# Altium project VESC_MotorController.PrjPcb
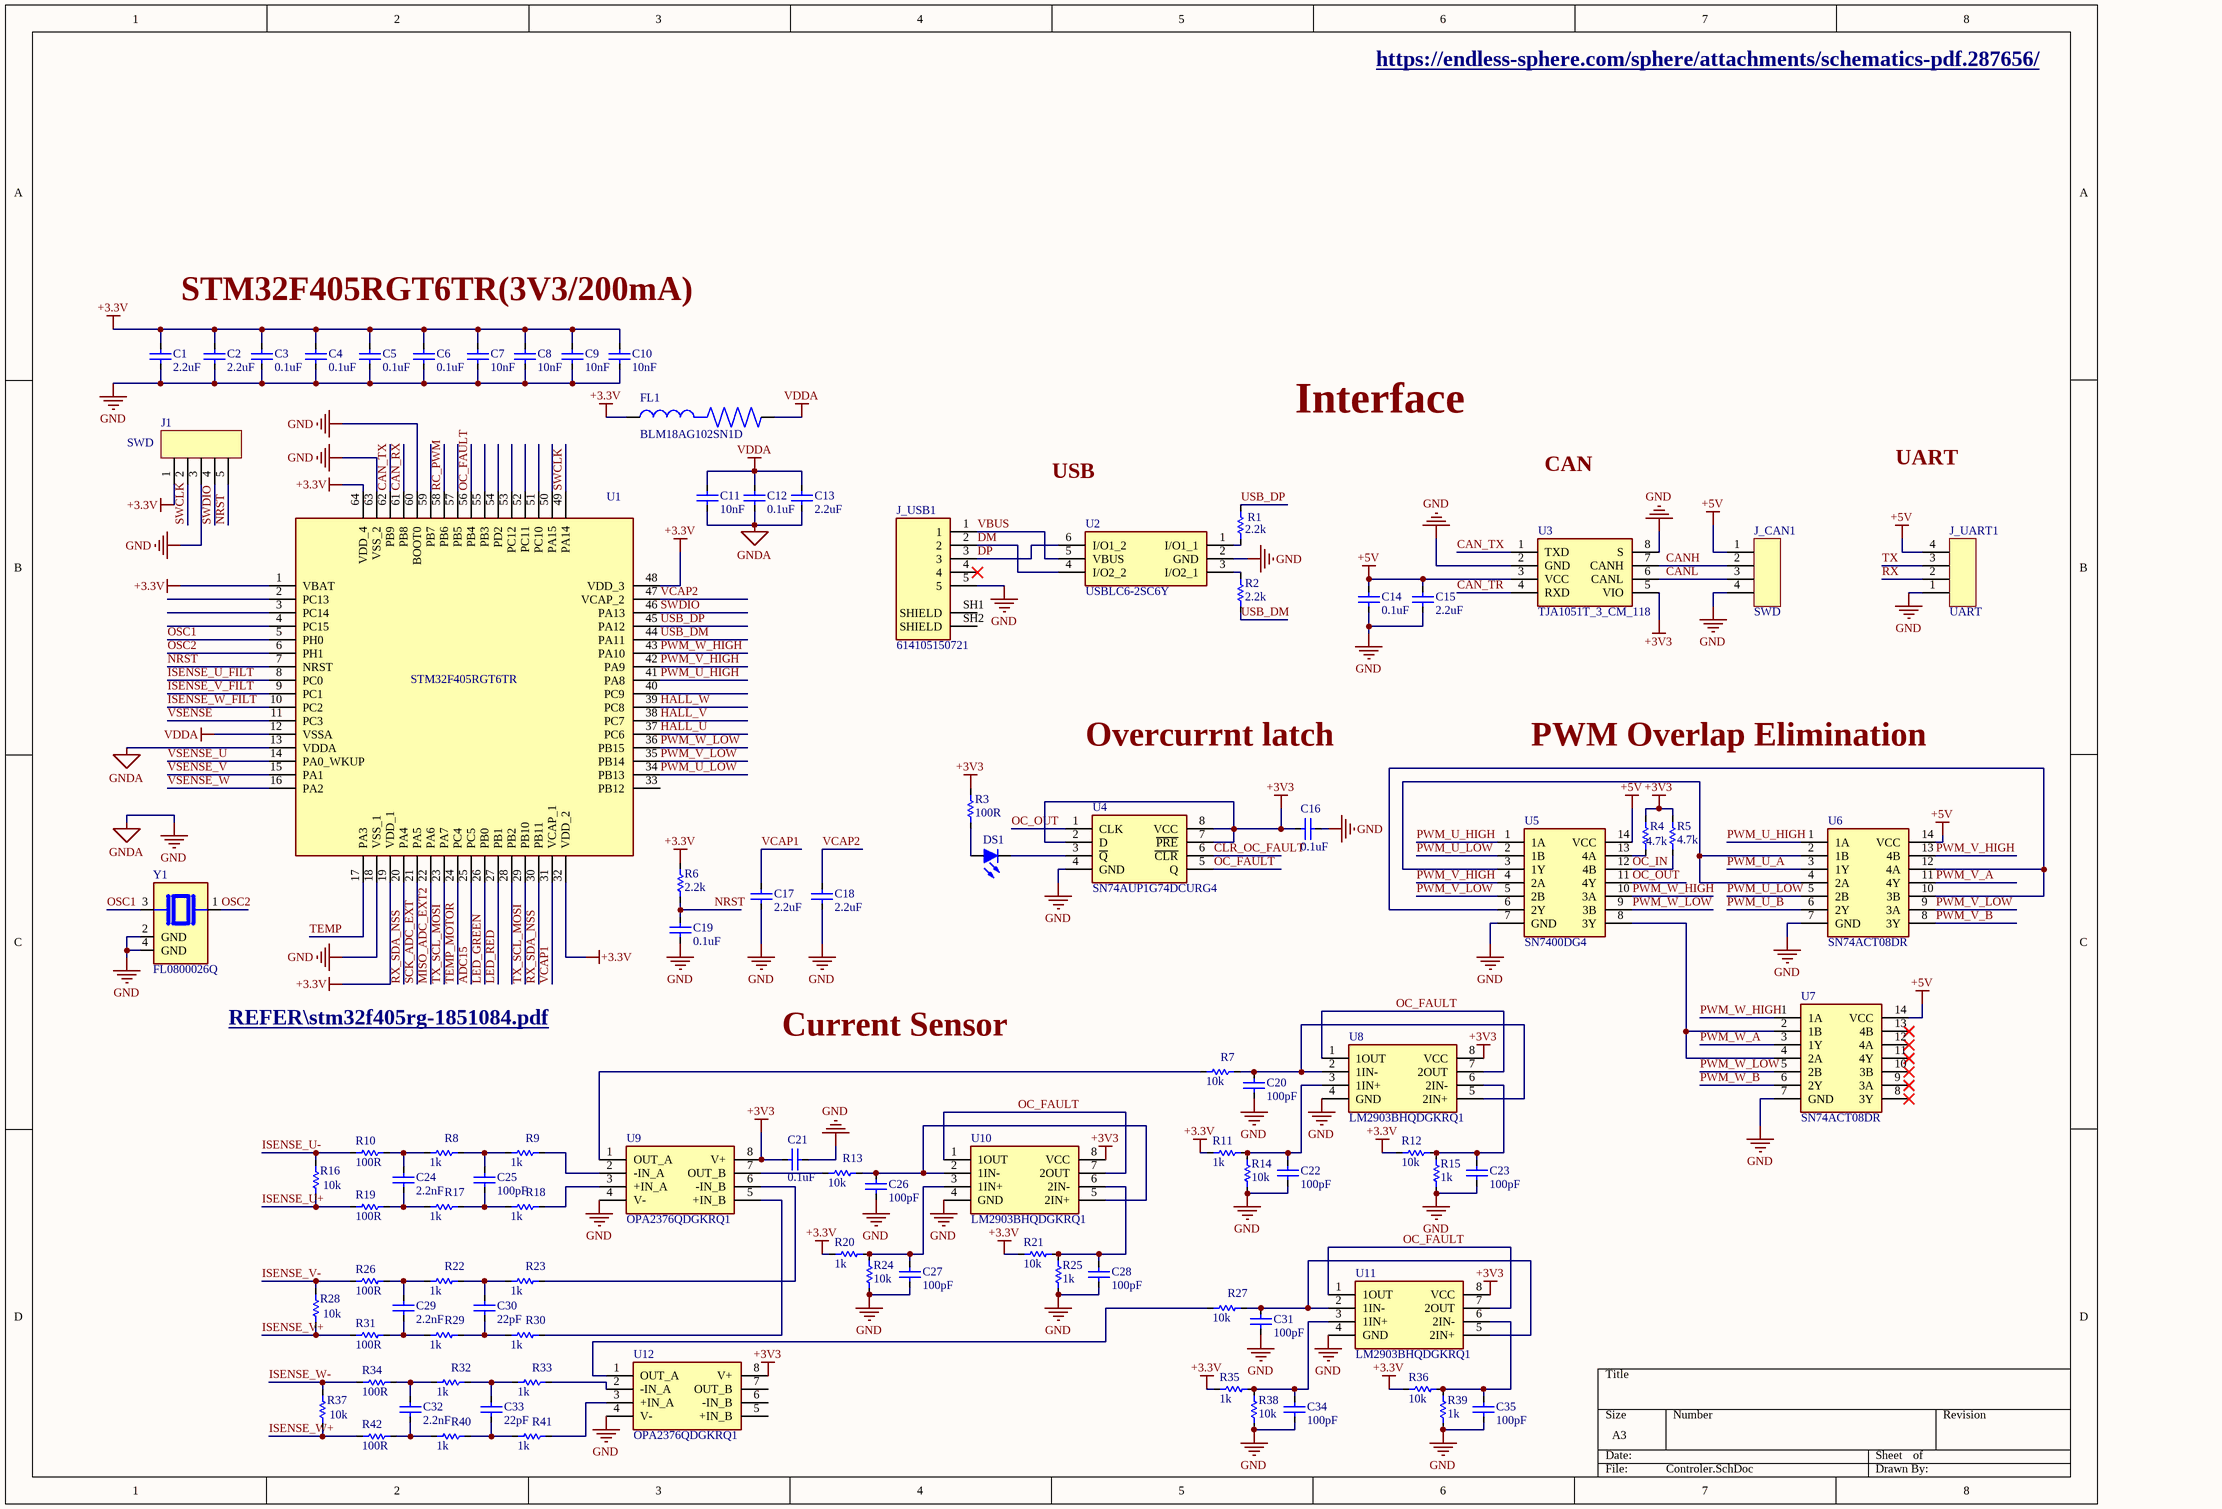
[diagram p0: Controler.SchDoc]
2 sheets, 226 parts. Net scope: global (net labels, ports and power ports of the same name join across sheets).
Board file: Controler.PcbDoc
Sheets:
  Controler.SchDoc
  PowerBoard.SchDoc

## Sheet Controler.SchDoc
size A3

### Parts
C1  2.2uF  [SMD_C(0603)]
C2  2.2uF  [SMD_C(0603)]
C3  0.1uF  [SMD_C(0402)]
C4  0.1uF  [SMD_C(0402)]
C5  0.1uF  [SMD_C(0402)]
C6  0.1uF  [SMD_C(0402)]
C7  10nF  [SMD_C(0402)]
C8  10nF  [SMD_C(0402)]
C9  10nF  [SMD_C(0402)]
C10  10nF  [SMD_C(0402)]
C11  10nF  [SMD_C(0402)]
C12  0.1uF  [SMD_C(0402)]
C13  2.2uF  [SMD_C(0603)]
C14  0.1uF  [SMD_C(0402)]
C15  2.2uF  [SMD_C(0603)]
C16  0.1uF  [SMD_C(0402)]
C17  2.2uF  [SMD_C(0603)]
C18  2.2uF  [SMD_C(0603)]
C19  0.1uF  [SMD_C(0402)]
C20  100pF  [SMD_C(0402)]
C21  0.1uF  [SMD_C(0402)]
C22  100pF  [SMD_C(0402)]
C23  100pF  [SMD_C(0402)]
C24  2.2nF  [SMD_C(0402)]
C25  100pF  [SMD_C(0402)]
C26  100pF  [SMD_C(0402)]
C27  100pF  [SMD_C(0402)]
C28  100pF  [SMD_C(0402)]
C29  2.2nF  [SMD_C(0402)]
C30  22pF  [SMD_C(0402)]
C31  100pF  [SMD_C(0402)]
C32  2.2nF  [SMD_C(0402)]
C33  22pF  [SMD_C(0402)]
C34  100pF  [SMD_C(0402)]
C35  100pF  [SMD_C(0402)]
DS1  SML-D12U1WT86  [LED0603]  (value not drawn)
FL1  BLM18AG102SN1D  [BEADC1608X95N]
J1  SWD  [Header-2.54m-5pin]
J_CAN1  SWD  [Header-2.54m-4pin]
J_UART1  UART  [Header-2.54m-4pin]
J_USB1  614105150721  [WURTH_614105150721]
R1  2.2k  [SMD_R(0402)]
R2  2.2k  [SMD_R(0402)]
R3  100R  [SMD_R(0402)]
R4  4.7k  [SMD_R(0402)]
R5  4.7k  [SMD_R(0402)]
R6  2.2k  [SMD_R(0402)]
R7  10k  [SMD_R(0402)]
R8  1k  [SMD_R(0402)]
R9  1k  [SMD_R(0402)]
R10  100R  [SMD_R(0402)]
R11  1k  [SMD_R(0402)]
R12  10k  [SMD_R(0402)]
R13  10k  [SMD_R(0402)]
R14  10k  [SMD_R(0402)]
R15  1k  [SMD_R(0402)]
R16  10k  [SMD_R(0402)]
R17  1k  [SMD_R(0402)]
R18  1k  [SMD_R(0402)]
R19  100R  [SMD_R(0402)]
R20  1k  [SMD_R(0402)]
R21  10k  [SMD_R(0402)]
R22  1k  [SMD_R(0402)]
R23  1k  [SMD_R(0402)]
R24  10k  [SMD_R(0402)]
R25  1k  [SMD_R(0402)]
R26  100R  [SMD_R(0402)]
R27  10k  [SMD_R(0402)]
R28  10k  [SMD_R(0402)]
R29  1k  [SMD_R(0402)]
R30  1k  [SMD_R(0402)]
R31  100R  [SMD_R(0402)]
R32  1k  [SMD_R(0402)]
R33  1k  [SMD_R(0402)]
R34  100R  [SMD_R(0402)]
R35  1k  [SMD_R(0402)]
R36  10k  [SMD_R(0402)]
R37  10k  [SMD_R(0402)]
R38  10k  [SMD_R(0402)]
R39  1k  [SMD_R(0402)]
R40  1k  [SMD_R(0402)]
R41  1k  [SMD_R(0402)]
R42  100R  [SMD_R(0402)]
U1  STM32F405RGT6TR  [QFP50P1200X1200X160-64N]
U2  USBLC6-2SC6Y  [SOT95P280X145-6N]
U3  TJA1051T_3_CM_118  [SOIC127P600X175-8N]
U4  SN74AUP1G74DCURG4  [SOP50P310X90-8N]
U5  SN7400DG4  [SOIC127P600X175-14N]
U6  SN74ACT08DR  [SOIC127P600X175-14N]
U7  SN74ACT08DR  [SOIC127P600X175-14N]
U8  LM2903BHQDGKRQ1  [SOP65P490X110-8N]
U9  OPA2376QDGKRQ1  [SOP65P490X110-8N]
U10  LM2903BHQDGKRQ1  [SOP65P490X110-8N]
U11  LM2903BHQDGKRQ1  [SOP65P490X110-8N]
U12  OPA2376QDGKRQ1  [SOP65P490X110-8N]
Y1  FL0800026Q  [XTAL_FL0800026Q]

### Nets
+3.3V: C1.2 C2.2 C3.2 C4.2 C5.2 C6.2 C7.2 C8.2 C9.2 C10.2 FL1.1 J1.1 R6.2 R11.1 R12.1 R20.1 R21.1 R35.1 R36.1 U1.1(VBAT) U1.19(VDD_1) U1.32(VDD_2) U1.48(VDD_3) U1.64(VDD_4)
+3V3: C16.2 C21.1 R3.2 R4.2 R5.2 U3.5(VIO) U4.2(D) U4.7(~{PRE}) U4.8(VCC) U8.8(VCC) U9.8(V+) U10.8(VCC) U11.8(VCC) U12.8(V+)
+5V: C14.2 C15.2 J_CAN1.1 J_UART1.4 U3.3(VCC) U5.14(VCC) U6.14(VCC) U7.14(VCC)
GND: C1.1 C2.1 C3.1 C4.1 C5.1 C6.1 C7.1 C8.1 C9.1 C10.1 C11.1 C12.1 C13.1 C14.1 C15.1 C16.1 C17.1 C18.1 C19.1 C20.1 C21.2 C22.1 C23.1 C26.1 C27.1 C28.1 C31.1 C34.1 C35.1 J1.3 J_CAN1.4 J_UART1.1 J_USB1.5 R14.2 R15.2 R24.2 R25.2 R38.2 R39.2 U1.13(VDDA) U1.18(VSS_1) U1.60(BOOT0) U1.63(VSS_2) U2.2(GND) U3.2(GND) U3.8(S) U4.4(GND) U5.7(GND) U6.7(GND) U7.7(GND) U8.4(GND) U9.4(V-) U10.4(GND) U11.4(GND) U12.4(V-) Y1.2(GND) Y1.4(GND)  [also labelled GNDA]
VDDA: C11.2 C12.2 C13.2 FL1.2 U1.12(VSSA)
ADC15: U1.25(PC5)
CAN_RX: U1.61(PB8)
CAN_TR: U3.4(RXD)
CAN_TX: U1.62(PB9) U3.1(TXD)
CANH: J_CAN1.2 U3.7(CANH)
CANL: J_CAN1.3 U3.6(CANL)
CLR_OC_FAULT: U4.6(~{CLR})
DM: J_USB1.2 U2.4(I/O2_2)
DP: J_USB1.3 U2.6(I/O1_2)
HALL_U: U1.37(PC6)
HALL_V: U1.38(PC7)
HALL_W: U1.39(PC8)
ISENSE_U+: R16.2 R19.2
ISENSE_U-: R10.2 R16.1
ISENSE_U_FILT: U1.8(PC0)
ISENSE_V+: R28.2 R31.2
ISENSE_V-: R26.2 R28.1
ISENSE_V_FILT: U1.9(PC1)
ISENSE_W+: R37.2 R42.2
ISENSE_W-: R34.2 R37.1
ISENSE_W_FILT: U1.10(PC2)
LED_GREEN: U1.26(PB0)
LED_RED: U1.27(PB1)
MISO_ADC_EXT2: U1.22(PA6)
NRST: C19.2 J1.5 R6.1 U1.7(NRST)
OC_FAULT: U1.56(PB4) U4.5(Q) U8.1(1OUT) U8.7(2OUT) U10.1(1OUT) U10.7(2OUT) U11.1(1OUT) U11.7(2OUT)
OC_IN: R5.1 U5.12(4B)
OC_OUT: U4.1(CLK) U5.11(4Y)
OSC1: U1.5(PH0) Y1.3
OSC2: U1.6(PH1) Y1.1
PWM_U_A: U6.3(1Y)
PWM_U_B: U6.6(2Y)
PWM_U_HIGH: U1.41(PA8) U5.1(1A) U6.1(1A)
PWM_U_LOW: U1.34(PB13) U5.2(1B) U6.5(2B)
PWM_V_A: U6.11(4Y)
PWM_V_B: U6.8(3Y)
PWM_V_HIGH: U1.42(PA9) U5.4(2A) U6.13(4B)
PWM_V_LOW: U1.35(PB14) U5.5(2B) U6.9(3A)
PWM_W_A: U7.3(1Y)
PWM_W_B: U7.6(2Y)
PWM_W_HIGH: U1.43(PA10) U5.10(3A) U7.1(1A)
PWM_W_LOW: U1.36(PB15) U5.9(3B) U7.5(2B)
RC_PWM: U1.58(PB6)
RX: J_UART1.2
RX_SDA_NSS: U1.20(PA4) U1.30(PB11)
SCK_ADC_EXT: U1.21(PA5)
SWCLK: J1.2 U1.49(PA14)
SWDIO: J1.4 U1.46(PA13)
TEMP: U1.17(PA3)
TEMP_MOTOR: U1.24(PC4)
TX: J_UART1.3
TX_SCL_MOSI: U1.23(PA7) U1.29(PB10)
USB_DM: R2.2 U1.44(PA11)
USB_DP: R1.2 U1.45(PA12)
VBUS: J_USB1.1 U2.5(VBUS)
VCAP1: C17.2 U1.31(VCAP_1)
VCAP2: C18.2 U1.47(VCAP_2)
VSENSE: U1.11(PC3)
VSENSE_U: U1.14(PA0_WKUP)
VSENSE_V: U1.15(PA1)
VSENSE_W: U1.16(PA2)
NetC20_2: C20.2 R7.1 U8.2(1IN-) U8.5(2IN+)
NetC22_2: C22.2 R11.2 R14.1 U8.3(1IN+)
NetC23_2: C23.2 R12.2 R15.1 U8.6(2IN-)
NetC24_1: C24.1 R17.2 R19.1
NetC24_2: C24.2 R8.2 R10.1
NetC25_1: C25.1 R17.1 R18.2
NetC25_2: C25.2 R8.1 R9.2
NetC26_2: C26.2 R13.1 U10.2(1IN-) U10.5(2IN+)
NetC27_2: C27.2 R20.2 R24.1 U10.3(1IN+)
NetC28_2: C28.2 R21.2 R25.1 U10.6(2IN-)
NetC29_1: C29.1 R29.2 R31.1
NetC29_2: C29.2 R22.2 R26.1
NetC30_1: C30.1 R29.1 R30.2
NetC30_2: C30.2 R22.1 R23.2
NetC31_2: C31.2 R27.1 U11.2(1IN-) U11.5(2IN+)
NetC32_1: C32.1 R40.2 R42.1
NetC32_2: C32.2 R32.2 R34.1
NetC33_1: C33.1 R40.1 R41.2
NetC33_2: C33.2 R32.1 R33.2
NetC34_2: C34.2 R35.2 R38.1 U11.3(1IN+)
NetC35_2: C35.2 R36.2 R39.1 U11.6(2IN-)
NetDS1_A: DS1.A R3.1
NetDS1_C: DS1.C U4.3(~{Q})
NetR1_1: R1.1 U2.1(I/O1_1)
NetR2_1: R2.1 U2.3(I/O2_1)
NetR4_1: R4.1 U5.13(4A)
NetR7_2: R7.2 U9.1(OUT_A)
NetR9_1: R9.1 U9.2(-IN_A)
NetR13_2: R13.2 U9.7(OUT_B)
NetR18_1: R18.1 U9.3(+IN_A)
NetR23_1: R23.1 U9.6(-IN_B)
NetR27_2: R27.2 U12.1(OUT_A)
NetR30_1: R30.1 U9.5(+IN_B)
NetR33_1: R33.1 U12.2(-IN_A)
NetR41_1: R41.1 U12.3(+IN_A)
NetU5_3: U5.3(1Y) U6.2(1B) U6.4(2A)
NetU5_6: U5.6(2Y) U6.10(3B) U6.12(4A)
NetU5_8: U5.8(3Y) U7.2(1B) U7.4(2A)

Not connected (* = marked no-connect by the designer): J_USB1 4* SH1(SHIELD) SH2(SHIELD); U1 2(PC13) 3(PC14) 4(PC15) 28(PB2) 33(PB12) 40(PC9) 50(PA15) 51(PC10) 52(PC11) 53(PC12) 54(PD2) 55(PB3) 57(PB5) 59(PB7); U7 8(3Y)* 9(3A)* 10(3B)* 11(4Y)* 12(4A)* 13(4B)*; U12 5(+IN_B) 6(-IN_B) 7(OUT_B)

### Notes on the sheet
- https://endless-sphere.com/sphere/attachments/schematics-pdf.287656/
- STM32F405RGT6TR(3V3/200mA)
- Interface
- USB
- CAN
- UART
- Overcurrnt latch
- PWM Overlap Elimination
- REFER\stm32f405rg-1851084.pdf <F:\TASK\2023\8\VESC_MotorController\REFER\STM32f405rg-1851084.pdf>
- Current Sensor

### Library data of the parts
C1 C2 C13 = Cap_9: PHE840MA6100MA04R17; Manufacturer: Yageo; Manufacturer Part Number: CC0603KPX7R9BB104; Supplier 1: Digi-Key; Supplier Part Number 1: 311-3567-1-ND
C3-C6 C12 C14 C16 C19 C21 = Cap_1: Multilayer Ceramic Capacitors MLCC - SMD/SMT 50 V 0.1uF X7R 0603 10%; Manufacturer: Yageo; Manufacturer Part Number: CC0603KPX7R9BB104; Supplier 1: Digi-Key; Supplier Part Number 1: 311-3567-1-ND
C7-C11 = Cap_2: Multilayer Ceramic Capacitors MLCC - SMD/SMT 50 V 10nF X7R 0603 10%; Manufacturer: Yageo; Manufacturer Part Number: CC0603KPX7R9BB103; Supplier 1: Digi-Key; Supplier Part Number 1: 311-3567-1-ND
C15 C17 C18 = Cap_4: Multilayer Ceramic Capacitors MLCC - SMD/SMT 2.2 uF 50 VDC 10% 1206 X7R AEC-Q200; Manufacturer: Yageo; Manufacturer Part Number: GCM31CR71H225KA55K; Supplier 1: Digi-Key; Supplier Part Number 1: 311-3567-1-ND
C20 C22-C35 = Cap_7: PHE840MA6100MA04R17; Manufacturer: Yageo; Manufacturer Part Number: CC0603KPX7R9BB104; Supplier 1: Digi-Key; Supplier Part Number 1: 311-3567-1-ND
DS1 = SML-D12U1WT86: Typical RED GaAs LED; Manufacturer: Rohm Semiconductor; Supplier: Mouser; Supplier Part Number: 755-SML-D12U1WT86; Manufacturer Part Number: SML-D12U1WT86; Value: SML-D12U1WT86; Price: 0.2
FL1 = BLM18AG102SN1D: 1 kOhms @ 100MHz 1 Ferrite Bead 0603 _1608 Metric_ 400mA 500mOhm; MF: Murata; Package: 1608 Murata; MP: BLM18AG102SN1D; Digi-Key_Purchase_URL: https://www.digikey.in/product-detail/en/murata-electronics/BLM18AG102SN1D/490-1015-1-ND/584463?utm_source=snapeda&utm_medium=aggregator&utm_campaign=symbol; Digi-Key_Part_Number: 490-1015-1-ND; Value: *; SnapEDA_Link: https://www.snapeda.com/parts/BLM18AG102SN1D/Murata/view-part/45181/?ref=snap
J1 = 5PinConnector
J_CAN1 J_UART1 = 4PinConnector
J_USB1 = 614105150721: USB - micro B USB 2.0 Receptacle Connector 5 Position Through Hole; MF: Wurth Electronics; Package: None; Digi-Key_Part_Number: 732-5958-1-ND; MP: 614105150721; SnapEDA_Link: https://www.snapeda.com/parts/614105150721/Wurth%20Electronics%20Inc./view-part/1118291/?ref=snap; Value: *; Digi-Key_Purchase_URL: https://www.digikey.com/product-detail/en/w-rth-elektronik/614105150721/732-5958-1-ND/5047553?utm_source=snapeda&utm_medium=aggregator&utm_campaign=symbol
R1 R2 R6 = Res Semi_2: CRCW04024R02FKED; Published: 8-Jun-2000; LatestRevisionDate: 17-Jul-2002; LatestRevisionNote: Re-released for DXP Platform.; PackageReference: AXIAL-0.5; Publisher: Altium Limited; PackageDescription: Axial Device, Thru-Hole; 2 Leads; 0.5 in Pin Spacing
R3 R7-R42 = Res Semi_1: CRCW04024R02FKED; Published: 8-Jun-2000; LatestRevisionDate: 17-Jul-2002; LatestRevisionNote: Re-released for DXP Platform.; PackageReference: AXIAL-0.5; Publisher: Altium Limited; PackageDescription: Axial Device, Thru-Hole; 2 Leads; 0.5 in Pin Spacing
R4 R5 = Res Semi_3: CRCW04024R02FKED; Published: 8-Jun-2000; LatestRevisionDate: 17-Jul-2002; LatestRevisionNote: Re-released for DXP Platform.; PackageReference: AXIAL-0.5; Publisher: Altium Limited; PackageDescription: Axial Device, Thru-Hole; 2 Leads; 0.5 in Pin Spacing
U1 = STM32F405RGT6TR: STM32F405RGT6TR, 32 bit ARM Cortex M4 MCU 168MHz 1024 kB Flash, 192 kB RAM, 2xUSB CAN I2C 64-Pin LQFP; Manufacturer_Name: STMicroelectronics; Geometry.Height: 1.6mm; Mouser Part Number: 511-STM32F405RGT6TR; Mouser Price/Stock: https://www.mouser.co.uk/ProductDetail/STMicroelectronics/STM32F405RGT6TR?qs=MavH1QghrkHshpR6GkvPIg%3D%3D; Manufacturer_Part_Number: STM32F405RGT6TR; Datasheet Link: http://www.st.com/web/en/resource/technical/document/datasheet/DM00037051.pdf
U2 = USBLC6-2SC6Y: Low Cap. ESD Protection Auto SOT-23-6 STMicroelectronics USBLC6-2SC6Y, Dual Uni-Directional TVS Diode Array, 6-Pin SOT-23; Geometry.Height: 1.45mm; Mouser Part Number: 511-USBLC6-2SC6Y; Mouser Price/Stock: https://www.mouser.co.uk/ProductDetail/STMicroelectronics/USBLC6-2SC6Y?qs=gNDSiZmRJS%2FOgDexvXkdow%3D%3D; Manufacturer_Name: STMicroelectronics; Manufacturer_Part_Number: USBLC6-2SC6Y; Datasheet Link: https://componentsearchengine.com/Datasheets/1/USBLC6-2SC6Y.pdf
U3 = TJA1051T_3_CM_118: CAN Interface IC BL Advanced Automotive Analog; Manufacturer_Name: NXP; Manufacturer_Part_Number: TJA1051T/3/CM,118; Geometry.Height: 1.75mm; Mouser Part Number: 771-TJA1051T/3CM118; Mouser Price/Stock: https://www.mouser.co.uk/ProductDetail/NXP-Semiconductors/TJA1051T-3-CM118?qs=5XOdhvmYM0NUkmo%252BpXvJfw%3D%3D; Datasheet Link: http://www.nxp.com/docs/en/data-sheet/TJA1051.pdf
U4 = SN74AUP1G74DCURG4: Flip Flops Lo PWR SNGL Pos Edge Trgrd DType FlipFlop; Manufacturer_Name: Texas Instruments; Geometry.Height: 0.9mm; Mouser Part Number: 595-74AUP1G74DCURG4; Mouser Price/Stock: https://www.mouser.co.uk/ProductDetail/Texas-Instruments/SN74AUP1G74DCURG4?qs=7kv20MEVUlhYDCdFtbMd%2FA%3D%3D; Manufacturer_Part_Number: SN74AUP1G74DCURG4; Datasheet Link: *
U5 = SN7400DG4: NAND Gate 4-Element 2-IN Bipolar 14-Pin SOIC Tube; Manufacturer_Name: Texas Instruments; Geometry.Height: 1.75mm; Mouser Part Number: 595-SN7400DG4; Mouser Price/Stock: https://www.mouser.co.uk/ProductDetail/Texas-Instruments/SN7400DG4?qs=E8lYj0tdJGGtKkNRXTqCCA%3D%3D; Manufacturer_Part_Number: SN7400DG4; Datasheet Link: https://www.arrow.com/en/products/sn7400dg4/texas-instruments
U6 U7 = SN74ACT08DR: Texas Instruments SN74ACT08DR, AND Quad 2 Input AND, 4.5  5.5 V, 14-Pin SOIC; Geometry.Height: 1.75mm; Mouser Part Number: 595-SN74ACT08DR; Mouser Price/Stock: https://www.mouser.co.uk/ProductDetail/Texas-Instruments/SN74ACT08DR?qs=AMJt07B76uu%2FkRdXJtIwhw%3D%3D; Manufacturer_Name: Texas Instruments; Manufacturer_Part_Number: SN74ACT08DR; Datasheet Link: http://www.ti.com/lit/gpn/sn74act08
U8 U10 U11 = LM2903BHQDGKRQ1: Analog Comparators Automotive, dual, differential, commodity comparator; Manufacturer_Name: Texas Instruments; Geometry.Height: 1.1mm; Mouser Part Number: 595-LM2903BHQDGKRQ1; Mouser Price/Stock: https://www.mouser.co.uk/ProductDetail/Texas-Instruments/LM2903BHQDGKRQ1?qs=By6Nw2ByBD2mW87GUmotXw%3D%3D; Manufacturer_Part_Number: LM2903BHQDGKRQ1; Datasheet Link: https://www.ti.com/lit/ds/symlink/lm2903b-q1.pdf?HQS=dis-mous-null-mousermode-dsf-pf-null-wwe&ts=1670767488652&ref_url=https%253A%252F%252Fwww.mouser.de%252F
U9 U12 = OPA2376QDGKRQ1: Low Noise, Low Quiescent Current, Precision Operational Amplifier e-trim/trade; Manufacturer_Name: Texas Instruments; Geometry.Height: 1.1mm; Mouser Part Number: 595-OPA2376QDGKRQ1; Mouser Price/Stock: https://www.mouser.co.uk/ProductDetail/Texas-Instruments/OPA2376QDGKRQ1?qs=zEmsApcVOkU338m46%2F1O7A%3D%3D; Manufacturer_Part_Number: OPA2376QDGKRQ1; Datasheet Link: http://www.ti.com/lit/gpn/opa2376-q1
Y1 = FL0800026Q: 8 MHz Â±30ppm Crystal 8pF 400 Ohms 4-SMD, No Lead; MF: Diodes Incorporated; Package: NON STANDARD-4 Diodes Inc.; Price: None; Check_prices: https://www.snapeda.com/parts/FL0800026Q/Diodes+Inc./view-part/?ref=eda; Value: *; SnapEDA_Link: https://www.snapeda.com/parts/FL0800026Q/Diodes+Inc./view-part/?ref=snap; MP: FL0800026Q; Availability: In Stock; Purchase-URL: https://pricing.snapeda.com/search?q=FL0800026Q&ref=eda

## Sheet PowerBoard.SchDoc: DriveHUB CardFrame - Backplane Power
size A3; Date: 01/08/22; Engineer: AJC; DocumentNumber: 35-735; Revision: D; SheetNumber: 1; SheetTotal: 3; Manager: AJC
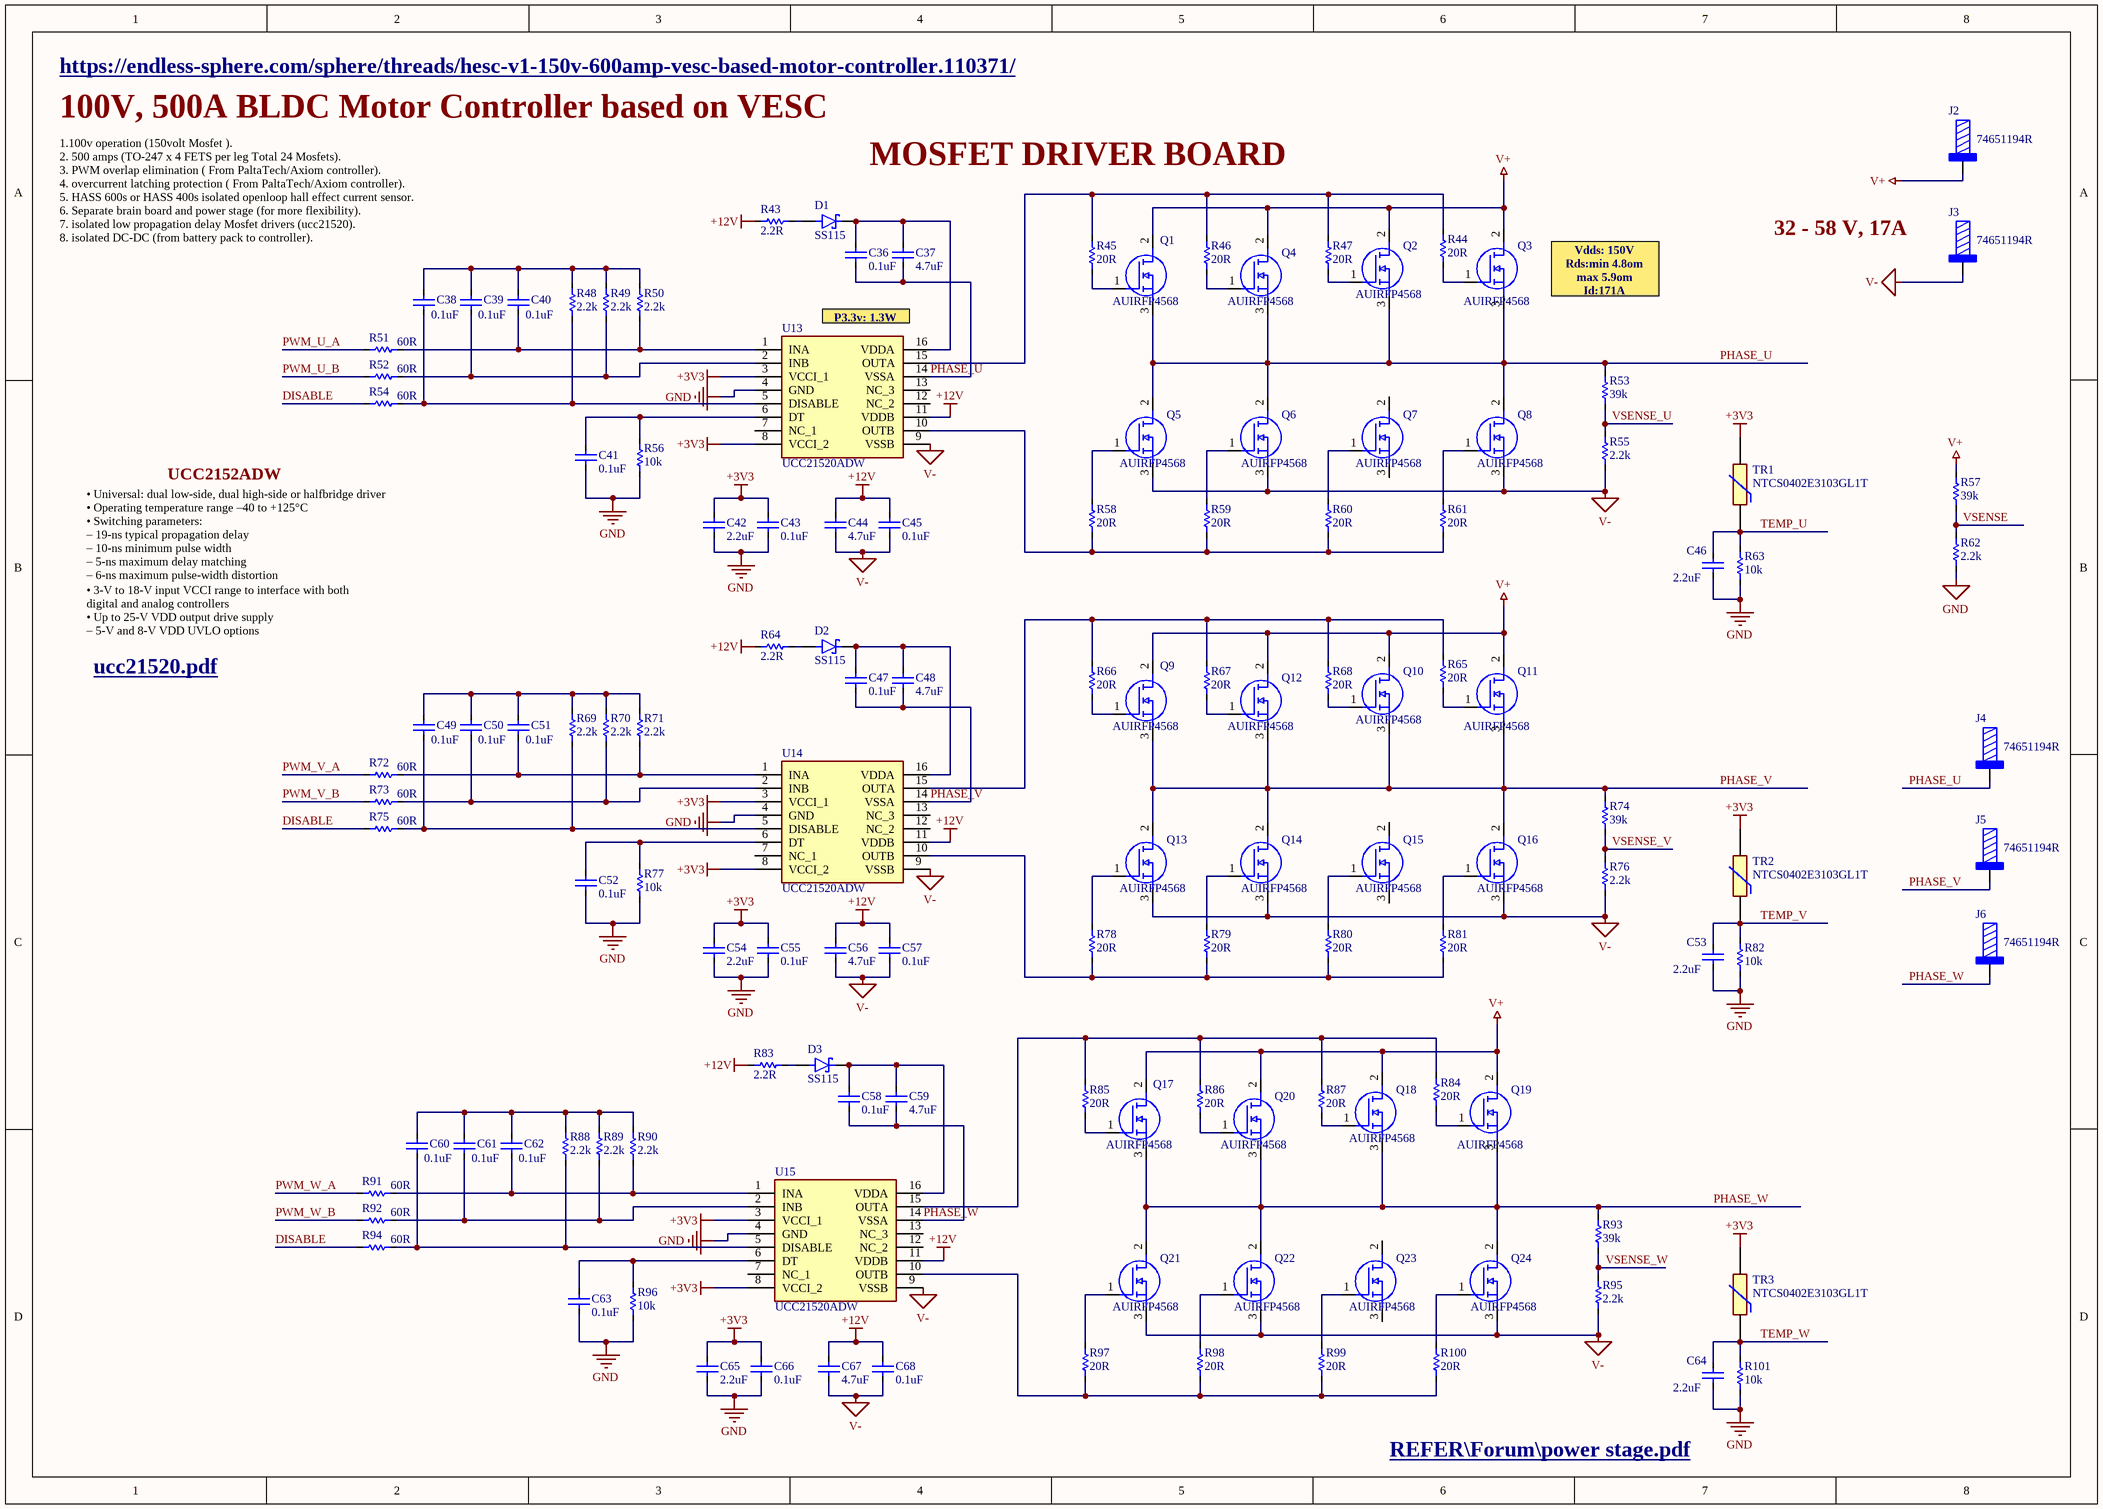
[diagram p1: PowerBoard.SchDoc]

### Parts
C36  0.1uF  [SMD_C(0402)]
C37  4.7uF  [SMD_C(0603)]
C38  0.1uF  [SMD_C(0402)]
C39  0.1uF  [SMD_C(0402)]
C40  0.1uF  [SMD_C(0402)]
C41  0.1uF  [SMD_C(0402)]
C42  2.2uF  [SMD_C(0603)]
C43  0.1uF  [SMD_C(0402)]
C44  4.7uF  [SMD_C(0603)]
C45  0.1uF  [SMD_C(0402)]
C46  2.2uF  [SMD_C(0402)]
C47  0.1uF  [SMD_C(0402)]
C48  4.7uF  [SMD_C(0603)]
C49  0.1uF  [SMD_C(0402)]
C50  0.1uF  [SMD_C(0402)]
C51  0.1uF  [SMD_C(0402)]
C52  0.1uF  [SMD_C(0402)]
C53  2.2uF  [SMD_C(0402)]
C54  2.2uF  [SMD_C(0603)]
C55  0.1uF  [SMD_C(0402)]
C56  4.7uF  [SMD_C(0603)]
C57  0.1uF  [SMD_C(0402)]
C58  0.1uF  [SMD_C(0402)]
C59  4.7uF  [SMD_C(0603)]
C60  0.1uF  [SMD_C(0402)]
C61  0.1uF  [SMD_C(0402)]
C62  0.1uF  [SMD_C(0402)]
C63  0.1uF  [SMD_C(0402)]
C64  2.2uF  [SMD_C(0402)]
C65  2.2uF  [SMD_C(0603)]
C66  0.1uF  [SMD_C(0402)]
C67  4.7uF  [SMD_C(0603)]
C68  0.1uF  [SMD_C(0402)]
D1  SS115  [DIOM4325X250N]
D2  SS115  [DIOM4325X250N]
D3  SS115  [DIOM4325X250N]
J2  74651194R  [74651194]
J3  74651194R  [74651194]
J4  74651194R  [74651194]
J5  74651194R  [74651194]
J6  74651194R  [74651194]
Q1  AUIRFP4568  [TO546P531X1558X2499-3P]
Q2  AUIRFP4568  [TO546P531X1558X2499-3P]
Q3  AUIRFP4568  [TO546P531X1558X2499-3P]
Q4  AUIRFP4568  [TO546P531X1558X2499-3P]
Q5  AUIRFP4568  [TO546P531X1558X2499-3P]
Q6  AUIRFP4568  [TO546P531X1558X2499-3P]
Q7  AUIRFP4568  [TO546P531X1558X2499-3P]
Q8  AUIRFP4568  [TO546P531X1558X2499-3P]
Q9  AUIRFP4568  [TO546P531X1558X2499-3P]
Q10  AUIRFP4568  [TO546P531X1558X2499-3P]
Q11  AUIRFP4568  [TO546P531X1558X2499-3P]
Q12  AUIRFP4568  [TO546P531X1558X2499-3P]
Q13  AUIRFP4568  [TO546P531X1558X2499-3P]
Q14  AUIRFP4568  [TO546P531X1558X2499-3P]
Q15  AUIRFP4568  [TO546P531X1558X2499-3P]
Q16  AUIRFP4568  [TO546P531X1558X2499-3P]
Q17  AUIRFP4568  [TO546P531X1558X2499-3P]
Q18  AUIRFP4568  [TO546P531X1558X2499-3P]
Q19  AUIRFP4568  [TO546P531X1558X2499-3P]
Q20  AUIRFP4568  [TO546P531X1558X2499-3P]
Q21  AUIRFP4568  [TO546P531X1558X2499-3P]
Q22  AUIRFP4568  [TO546P531X1558X2499-3P]
Q23  AUIRFP4568  [TO546P531X1558X2499-3P]
Q24  AUIRFP4568  [TO546P531X1558X2499-3P]
R43  2.2R  [SMD_R(0402)]
R44  20R  [SMD_R(0402)]
R45  20R  [SMD_R(0402)]
R46  20R  [SMD_R(0402)]
R47  20R  [SMD_R(0402)]
R48  2.2k  [SMD_R(0402)]
R49  2.2k  [SMD_R(0402)]
R50  2.2k  [SMD_R(0402)]
R51  60R  [SMD_R(0402)]
R52  60R  [SMD_R(0402)]
R53  39k  [SMD_R(0402)]
R54  60R  [SMD_R(0402)]
R55  2.2k  [SMD_R(0402)]
R56  10k  [SMD_R(0402)]
R57  39k  [SMD_R(0402)]
R58  20R  [SMD_R(0402)]
R59  20R  [SMD_R(0402)]
R60  20R  [SMD_R(0402)]
R61  20R  [SMD_R(0402)]
R62  2.2k  [SMD_R(0402)]
R63  10k  [SMD_R(0402)]
R64  2.2R  [SMD_R(0402)]
R65  20R  [SMD_R(0402)]
R66  20R  [SMD_R(0402)]
R67  20R  [SMD_R(0402)]
R68  20R  [SMD_R(0402)]
R69  2.2k  [SMD_R(0402)]
R70  2.2k  [SMD_R(0402)]
R71  2.2k  [SMD_R(0402)]
R72  60R  [SMD_R(0402)]
R73  60R  [SMD_R(0402)]
R74  39k  [SMD_R(0402)]
R75  60R  [SMD_R(0402)]
R76  2.2k  [SMD_R(0402)]
R77  10k  [SMD_R(0402)]
R78  20R  [SMD_R(0402)]
R79  20R  [SMD_R(0402)]
R80  20R  [SMD_R(0402)]
R81  20R  [SMD_R(0402)]
R82  10k  [SMD_R(0402)]
R83  2.2R  [SMD_R(0402)]
R84  20R  [SMD_R(0402)]
R85  20R  [SMD_R(0402)]
R86  20R  [SMD_R(0402)]
R87  20R  [SMD_R(0402)]
R88  2.2k  [SMD_R(0402)]
R89  2.2k  [SMD_R(0402)]
R90  2.2k  [SMD_R(0402)]
R91  60R  [SMD_R(0402)]
R92  60R  [SMD_R(0402)]
R93  39k  [SMD_R(0402)]
R94  60R  [SMD_R(0402)]
R95  2.2k  [SMD_R(0402)]
R96  10k  [SMD_R(0402)]
R97  20R  [SMD_R(0402)]
R98  20R  [SMD_R(0402)]
R99  20R  [SMD_R(0402)]
R100  20R  [SMD_R(0402)]
R101  10k  [SMD_R(0402)]
TR1  NTCS0402E3103GL1T  [THRMC1005X65N]
TR2  NTCS0402E3103GL1T  [THRMC1005X65N]
TR3  NTCS0402E3103GL1T  [THRMC1005X65N]
U13  UCC21520ADW  [SOIC127P1030X265-16N]
U14  UCC21520ADW  [SOIC127P1030X265-16N]
U15  UCC21520ADW  [SOIC127P1030X265-16N]

### Nets
+3V3: C42.2 C43.2 C54.2 C55.2 C65.2 C66.2 TR1.2 TR2.2 TR3.2 U13.3(VCCI_1) U13.8(VCCI_2) U14.3(VCCI_1) U14.8(VCCI_2) U15.3(VCCI_1) U15.8(VCCI_2)
+12V: C44.2 C45.2 C56.2 C57.2 C67.2 C68.2 R43.1 R64.1 R83.1 U13.11(VDDB) U14.11(VDDB) U15.11(VDDB)
GND: C41.1 C42.1 C43.1 C46.1 C52.1 C53.1 C54.1 C55.1 C63.1 C64.1 C65.1 C66.1 R56.1 R62.1 R63.1 R77.1 R82.1 R96.1 R101.1 U13.4(GND) U14.4(GND) U15.4(GND)
V+: J2.1 Q1.2(D) Q2.2(D) Q3.2(D) Q4.2(D) Q9.2(D) Q10.2(D) Q11.2(D) Q12.2(D) Q17.2(D) Q18.2(D) Q19.2(D) Q20.2(D) R57.2
V-: C44.1 C45.1 C56.1 C57.1 C67.1 C68.1 J3.1 Q5.3(S) Q6.3(S) Q8.3(S) Q13.3(S) Q14.3(S) Q16.3(S) Q21.3(S) Q22.3(S) Q24.3(S) R55.1 R76.1 R95.1 U13.9(VSSB) U14.9(VSSB) U15.9(VSSB)
DISABLE: R54.1 R75.1 R94.1
PHASE_U: C36.1 C37.1 J4.1 Q1.3(S) Q2.3(S) Q3.3(S) Q4.3(S) Q5.2(D) Q6.2(D) Q8.2(D) R53.2 U13.14(VSSA)
PHASE_V: C47.1 C48.1 J5.1 Q9.3(S) Q10.3(S) Q11.3(S) Q12.3(S) Q13.2(D) Q14.2(D) Q16.2(D) R74.2 U14.14(VSSA)
PHASE_W: C58.1 C59.1 J6.1 Q17.3(S) Q18.3(S) Q19.3(S) Q20.3(S) Q21.2(D) Q22.2(D) Q24.2(D) R93.2 U15.14(VSSA)
PWM_U_A: R51.1
PWM_U_B: R52.1
PWM_V_A: R72.1
PWM_V_B: R73.1
PWM_W_A: R91.1
PWM_W_B: R92.1
TEMP_U: C46.2 R63.2 TR1.1
TEMP_V: C53.2 R82.2 TR2.1
TEMP_W: C64.2 R101.2 TR3.1
VSENSE: R57.1 R62.2
VSENSE_U: R53.1 R55.2
VSENSE_V: R74.1 R76.2
VSENSE_W: R93.1 R95.2
NetC36_2: C36.2 C37.2 D1.C(K) U13.16(VDDA)
NetC38_1: C38.1 R48.1 R54.2 U13.5(DISABLE)
NetC38_2: C38.2 C39.2 C40.2 R48.2 R49.2 R50.2
NetC39_1: C39.1 R49.1 R52.2 U13.2(INB)
NetC40_1: C40.1 R50.1 R51.2 U13.1(INA)
NetC41_2: C41.2 R56.2 U13.6(DT)
NetC47_2: C47.2 C48.2 D2.C(K) U14.16(VDDA)
NetC49_1: C49.1 R69.1 R75.2 U14.5(DISABLE)
NetC49_2: C49.2 C50.2 C51.2 R69.2 R70.2 R71.2
NetC50_1: C50.1 R70.1 R73.2 U14.2(INB)
NetC51_1: C51.1 R71.1 R72.2 U14.1(INA)
NetC52_2: C52.2 R77.2 U14.6(DT)
NetC58_2: C58.2 C59.2 D3.C(K) U15.16(VDDA)
NetC60_1: C60.1 R88.1 R94.2 U15.5(DISABLE)
NetC60_2: C60.2 C61.2 C62.2 R88.2 R89.2 R90.2
NetC61_1: C61.1 R89.1 R92.2 U15.2(INB)
NetC62_1: C62.1 R90.1 R91.2 U15.1(INA)
NetC63_2: C63.2 R96.2 U15.6(DT)
NetD1_A: D1.A R43.2
NetD2_A: D2.A R64.2
NetD3_A: D3.A R83.2
NetQ1_1: Q1.1(G) R45.1
NetQ2_1: Q2.1(G) R47.1
NetQ3_1: Q3.1(G) R44.1
NetQ4_1: Q4.1(G) R46.1
NetQ5_1: Q5.1(G) R58.2
NetQ6_1: Q6.1(G) R59.2
NetQ7_1: Q7.1(G) R60.2
NetQ8_1: Q8.1(G) R61.2
NetQ9_1: Q9.1(G) R66.1
NetQ10_1: Q10.1(G) R68.1
NetQ11_1: Q11.1(G) R65.1
NetQ12_1: Q12.1(G) R67.1
NetQ13_1: Q13.1(G) R78.2
NetQ14_1: Q14.1(G) R79.2
NetQ15_1: Q15.1(G) R80.2
NetQ16_1: Q16.1(G) R81.2
NetQ17_1: Q17.1(G) R85.1
NetQ18_1: Q18.1(G) R87.1
NetQ19_1: Q19.1(G) R84.1
NetQ20_1: Q20.1(G) R86.1
NetQ21_1: Q21.1(G) R97.2
NetQ22_1: Q22.1(G) R98.2
NetQ23_1: Q23.1(G) R99.2
NetQ24_1: Q24.1(G) R100.2
NetR44_2: R44.2 R45.2 R46.2 R47.2 U13.15(OUTA)
NetR58_1: R58.1 R59.1 R60.1 R61.1 U13.10(OUTB)
NetR65_2: R65.2 R66.2 R67.2 R68.2 U14.15(OUTA)
NetR78_1: R78.1 R79.1 R80.1 R81.1 U14.10(OUTB)
NetR84_2: R84.2 R85.2 R86.2 R87.2 U15.15(OUTA)
NetR97_1: R97.1 R98.1 R99.1 R100.1 U15.10(OUTB)

Not connected (* = marked no-connect by the designer): Q7 2(D) 3(S); Q15 2(D) 3(S); Q23 2(D) 3(S); U13 7(NC_1) 12(NC_2) 13(NC_3); U14 7(NC_1) 12(NC_2) 13(NC_3); U15 7(NC_1) 12(NC_2) 13(NC_3)

### Notes on the sheet
- https://endless-sphere.com/sphere/threads/hesc-v1-150v-600amp-vesc-based-motor-controller.110371/
- 100V, 500A BLDC Motor Controller based on VESC
- MOSFET DRIVER BOARD
- (near J3) 32 - 58 V, 17A
- 1.100v operation (150volt Mosfet ).
  2. 500 amps (TO-247 x 4 FETS per leg Total 24 Mosfets).
  3. PWM overlap elimination ( From PaltaTech/Axiom controller).
  4. overcurrent latching protection ( From PaltaTech/Axiom controller).
  5. HASS 600s or HASS 400s isolated openloop hall effect current sensor.
  6. Separate brain board and power stage (for more flexibility).
  7. isolated low propagation delay Mosfet drivers (ucc21520).
  8. isolated DC-DC (from battery pack to controller).
- (near U13) P3.3v: 1.3W
- (near Q3) Vdds: 150V
  Rds:min 4.8om
  max 5.9om
  Id:171A
- UCC2152ADW
- • Universal: dual low-side, dual high-side or halfbridge driver
  • Operating temperature range –40 to +125°C
  • Switching parameters:
  – 19-ns typical propagation delay
  – 10-ns minimum pulse width
  – 5-ns maximum delay matching
  – 6-ns maximum pulse-width distortion
- • 3-V to 18-V input VCCI range to interface with both
  digital and analog controllers
  • Up to 25-V VDD output drive supply
  – 5-V and 8-V VDD UVLO options
- ucc21520.pdf <F:\TASK\2023\8\VESC_MotorController\REFER\ucc21520.pdf>
- REFER\Forum\power stage.pdf <F:\TASK\2023\8\VESC_MotorController\REFER\Forum\power stage.pdf>

### Library data of the parts
C36 C38-C41 C43 C45 C47 C49-C52 C55 C57 C58 C60-C63 C66 C68 = Cap_1: as C3 on sheet Controler; Supplier 1: Digi-Key; Supplier Part Number 1: 311-3567-1-ND
C37 C42 C44 C48 C54 C56 C59 C65 C67 = Cap_10: PHE840MA6100MA04R17; Manufacturer: Yageo; Manufacturer Part Number: CC0603KPX7R9BB104; Supplier 1: Digi-Key; Supplier Part Number 1: 311-3567-1-ND
C46 C53 C64 = Cap_1: Multilayer Ceramic Capacitors MLCC - SMD/SMT 50 V 0.1uF X7R 0603 10%
D1-D3 = SS115: 1A, 150V, Schottky Rectifier; MF: Taiwan Semiconductor; Package: DO-214AC-2 Taiwan Semiconductor; Check_prices: https://www.snapeda.com/parts/SS115/Taiwan+Semiconductor/view-part/?ref=eda; Value: *; Price: None; Purchase-URL: https://pricing.snapeda.com/search/part/SS115/?ref=eda; MP: SS115; SnapEDA_Link: https://www.snapeda.com/parts/SS115/Taiwan+Semiconductor/view-part/?ref=snap; Availability: In Stock
J2-J6 = 74651194R: WP-THRSH REDCUBE THR with external thread, M4 x 5mm, 85A; Manufacturer: Wurth Elektronik; Surface: Tin; ComponentLink1Description: Website Link; ComponentLink1URL: https://www.we-online.com/redexpert/article/74651194R?ad; ComponentLink2Description: Datasheet Link; ComponentLink2URL: https://www.we-online.com/redexpert/spec/74651194R?ad; Manufacturer Part Number: 74651194R; Category: REDCUBE THR; Match Code: WP-THRSH; Mount: Through Hole Reflow; Operating Temperature Max: 150°C; Operating Temperature Min: -55°C; Packaging: Tape and Reel; Length: 10mm; Width: 10mm; Height: 8.5mm; Material: Brass; Number of Pins: 9; Rated Current: 85A; Thread Length: 5mm; Thread Size: M4; Supplier: Mouser; Supplier Part Number: 710-74651195R; Price: 3.5; Value: 74651194R
Q1-Q24 = AUIRFP4568: MOSFET N-CHANNEL 100+; Manufacturer_Name: Infineon; Geometry.Height: 5.31mm; Mouser Part Number: 942-AUIRFP4568; Mouser Price/Stock: https://www.mouser.co.uk/ProductDetail/Infineon-IR/AUIRFP4568?qs=m1T3c8F5IUIdoWYie9aRBg%3D%3D; Manufacturer_Part_Number: AUIRFP4568; Datasheet Link: https://www.infineon.com/dgdl/auirfp4568.pdf?fileId=5546d462533600a4015355b1d8751458
R43-R47 R51 R52 R54 R58-R61 R64-R68 R72 R73 R75 R78-R81 R83-R87 R91 R92 R94 R97-R100 = Res Semi_1: CRCW04024R02FKED; Published: 8-Jun-2000; LatestRevisionDate: 17-Jul-2002; LatestRevisionNote: Re-released for DXP Platform.; PackageReference: AXIAL-0.5; Publisher: Altium Limited; PackageDescription: Axial Device, Thru-Hole; 2 Leads; 0.5 in Pin Spacing
R48-R50 R69-R71 R88-R90 = Res Semi_2: CRCW04024R02FKED; Published: 8-Jun-2000; LatestRevisionDate: 17-Jul-2002; LatestRevisionNote: Re-released for DXP Platform.; PackageReference: AXIAL-0.5; Publisher: Altium Limited; PackageDescription: Axial Device, Thru-Hole; 2 Leads; 0.5 in Pin Spacing
R53 R55-R57 R62 R63 R74 R76 R77 R82 R93 R95 R96 R101 = Res Semi_5: CRCW04024R02FKED; Published: 8-Jun-2000; LatestRevisionDate: 17-Jul-2002; LatestRevisionNote: Re-released for DXP Platform.; PackageReference: AXIAL-0.5; Publisher: Altium Limited; PackageDescription: Axial Device, Thru-Hole; 2 Leads; 0.5 in Pin Spacing
TR1-TR3 = NTCS0402E3103GL1T: NTC Thermistors 10Kohms 2% AEC-Q200; Manufacturer_Name: Vishay; Geometry.Height: 0.65mm; Mouser Part Number: 594-NTCS402E3103GL1T; Mouser Price/Stock: https://www.mouser.co.uk/ProductDetail/Vishay-BC-Components/NTCS0402E3103GL1T?qs=u16ybLDytRYI8lwq3wWutw%3D%3D; Manufacturer_Part_Number: NTCS0402E3103GL1T; Datasheet Link: https://www.mouser.in/datasheet/2/427/ntcs0402e3t-1762119.pdf
U13-U15 = UCC21520ADW: 4A/6A, 5.7 kVrms Isolated Dual Channel Gate Driver; Manufacturer_Name: Texas Instruments; Geometry.Height: 2.65mm; Mouser Part Number: 595-UCC21520ADW; Mouser Price/Stock: https://www.mouser.co.uk/ProductDetail/Texas-Instruments/UCC21520ADW?qs=%2FP2Ij7fVdhFsQr%252B%2F6P1laA%3D%3D; Manufacturer_Part_Number: UCC21520ADW; Datasheet Link: http://www.ti.com/lit/gpn/ucc21520

## Nets that join several sheets
+3V3: Controler (14 pins), PowerBoard (15 pins)
GND: Controler (57 pins), PowerBoard (22 pins)
PWM_U_A: Controler (U6.3), PowerBoard (R51.1)
PWM_U_B: Controler (U6.6), PowerBoard (R52.1)
PWM_V_A: Controler (U6.11), PowerBoard (R72.1)
PWM_V_B: Controler (U6.8), PowerBoard (R73.1)
PWM_W_A: Controler (U7.3), PowerBoard (R91.1)
PWM_W_B: Controler (U7.6), PowerBoard (R92.1)
VSENSE: Controler (U1.11), PowerBoard (R57.1 R62.2)
VSENSE_U: Controler (U1.14), PowerBoard (R53.1 R55.2)
VSENSE_V: Controler (U1.15), PowerBoard (R74.1 R76.2)
VSENSE_W: Controler (U1.16), PowerBoard (R93.1 R95.2)

## Assembly variants
External Regulator Board: not fitted C14 C15 C16 C20 C21 C22 C23 C24 C31 C32 C33 C34 C35 C36 C37 C38 C39 C40 C41 C66 C67 C68 D2 D3 Q1 Q3 Q4 Q7 Q8 Q9 R1 R2 R3 R4 R5 R7 R8 R10 R11 R14 R15 R16 R17 R18 R19 R20 R21 R46 R91 R94 R95 R96 U3 U5
Onboard Regulators: all parts fitted